# Altium schematic sheet RP2040.SchDoc
size A; SheetNumber: 3; SheetTotal: 3
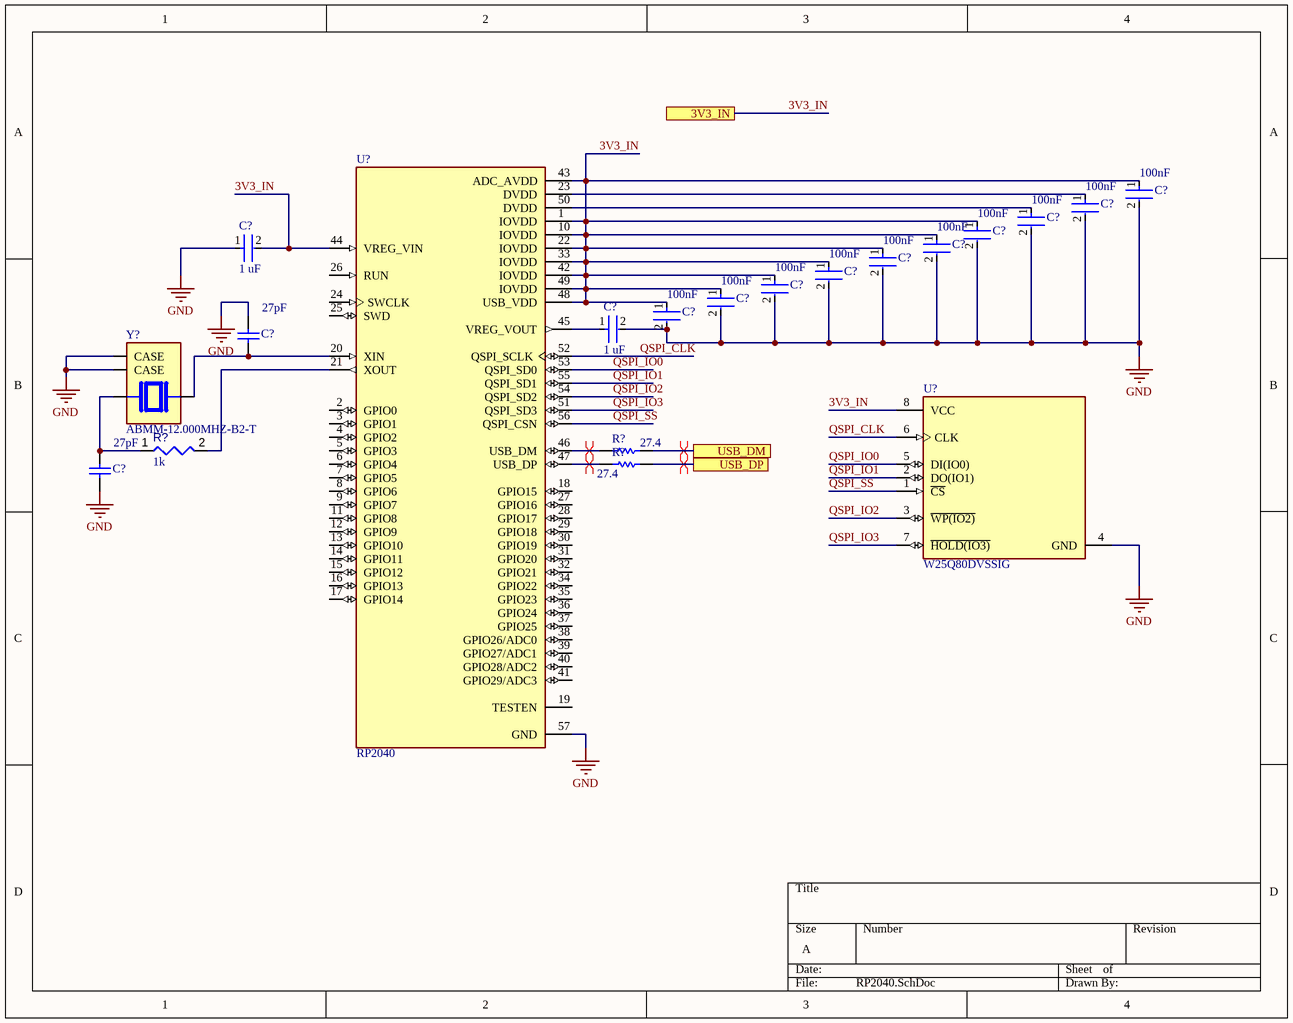
[diagram p0: RP2040.SchDoc]

## Parts
(Parts that share a designator on the sheet are numbered #1, #2 ... from top to bottom, then left to right.)
C?#1  Capacitance: 100nF  [FP-GRM155-0_05-MFG]  (hidden comment: GRM155R71C104KA88J)
C?#2  Capacitance: 100nF  [FP-GRM155-0_05-MFG]  (hidden comment: GRM155R71C104KA88J)
C?#3  Capacitance: 100nF  [FP-GRM155-0_05-MFG]  (hidden comment: GRM155R71C104KA88J)
C?#4  Capacitance: 100nF  [FP-GRM155-0_05-MFG]  (hidden comment: GRM155R71C104KA88J)
C?#5  Capacitance: 100nF  [FP-GRM155-0_05-MFG]  (hidden comment: GRM155R71C104KA88J)
C?#6  value 1 uF  [FP-CC0603-DA-MFG]  (hidden comment: CC0603KRX7R7BB105)
C?#7  Capacitance: 100nF  [FP-GRM155-0_05-MFG]  (hidden comment: GRM155R71C104KA88J)
C?#8  Capacitance: 100nF  [FP-GRM155-0_05-MFG]  (hidden comment: GRM155R71C104KA88J)
C?#9  Capacitance: 100nF  [FP-GRM155-0_05-MFG]  (hidden comment: GRM155R71C104KA88J)
C?#10  Capacitance: 100nF  [FP-GRM155-0_05-MFG]  (hidden comment: GRM155R71C104KA88J)
C?#11  Capacitance: 100nF  [FP-GRM155-0_05-MFG]  (hidden comment: GRM155R71C104KA88J)
C?#12  value 27pF  [CAPC1005X55X25LL05T10]  (hidden comment: GRM1555C1H270JA01D)
C?#13  value 1 uF  [FP-CC0603-DA-MFG]  (hidden comment: CC0603KRX7R7BB105)
C?#14  value 27pF  [CAPC1005X55X25LL05T10]  (hidden comment: GRM1555C1H270JA01D)
R?#1  value 27.4  [RESC1005X40X25ML05T10]  (hidden comment: RC0402FR-0727R4L)
R?#2  value 1k  [RESC1005X40X25ML10T10]  (hidden comment: Resistor 1k +/-5% 0402 63 mW)
R?#3  value 27.4  [RESC1005X40X25ML05T10]  (hidden comment: RC0402FR-0727R4L)
U?#1  W25Q80DVSSIG  [FP-SS-MFG]
U?#2  RP2040  [QFN40P700X700X90-57N]
Y?  ABMM-12.000MHZ-B2-T  [XTAL_ABMM-12.000MHZ-B2-T]

## Ports
3V3_IN, USB_DM, USB_DP

## Nets
GND: C?#1.2 C?#2.2 C?#3.2 C?#4.2 C?#5.2 C?#6.1 C?#7.2 C?#8.2 C?#9.2 C?#10.2 C?#11.2 C?#12.1 C?#13.2 C?#14.2 U?#1.4(GND) U?#2.57(GND) Y?.2(CASE) Y?.4(CASE)
3V3_IN: C?#1.1 C?#4.1 C?#5.1 C?#6.2 C?#7.1 C?#8.1 C?#9.1 C?#10.1 C?#11.1 U?#1.8(VCC) U?#2.1(IOVDD) U?#2.10(IOVDD) U?#2.22(IOVDD) U?#2.33(IOVDD) U?#2.42(IOVDD) U?#2.43(ADC_AVDD) U?#2.44(VREG_VIN) U?#2.48(USB_VDD) U?#2.49(IOVDD) ; port 3V3_IN
QSPI_CLK: U?#1.6(CLK) U?#2.52(QSPI_SCLK)
QSPI_IO0: U?#1.5(DI(IO0)) U?#2.53(QSPI_SD0)
QSPI_IO1: U?#1.2(DO(IO1)) U?#2.55(QSPI_SD1)
QSPI_IO2: U?#1.3(~{WP(IO2)}) U?#2.54(QSPI_SD2)
QSPI_IO3: U?#1.7(~{HOLD(IO3)}) U?#2.51(QSPI_SD3)
QSPI_SS: U?#1.1(~{CS}) U?#2.56(QSPI_CSN)
USB_DM: R?#1.2 ; port USB_DM
USB_DP: R?#3.2 ; port USB_DP
NetC?#2_1: C?#2.1 U?#2.23(DVDD)
NetC?#3_1: C?#3.1 U?#2.50(DVDD)
NetC?#12_2: C?#12.2 U?#2.20(XIN) Y?.1
NetC?#13_1: C?#13.1 U?#2.45(VREG_VOUT)
NetC?#14_1: C?#14.1 R?#2.1 Y?.3
NetR?#1_1: R?#1.1 U?#2.46(USB_DM)
NetR?#2_2: R?#2.2 U?#2.21(XOUT)
NetR?#3_1: R?#3.1 U?#2.47(USB_DP)

Not connected (* = marked no-connect by the designer): U?#2 2(GPIO0) 3(GPIO1) 4(GPIO2) 5(GPIO3) 6(GPIO4) 7(GPIO5) 8(GPIO6) 9(GPIO7) 11(GPIO8) 12(GPIO9) 13(GPIO10) 14(GPIO11) 15(GPIO12) 16(GPIO13) 17(GPIO14) 18(GPIO15) 19(TESTEN) 24(SWCLK) 25(SWD) 26(RUN) 27(GPIO16) 28(GPIO17) 29(GPIO18) 30(GPIO19) 31(GPIO20) 32(GPIO21) 34(GPIO22) 35(GPIO23) 36(GPIO24) 37(GPIO25) 38(GPIO26/ADC0) 39(GPIO27/ADC1) 40(GPIO28/ADC2) 41(GPIO29/ADC3)

## Layout directives
differential pair: NetR?#1_1, NetR?#3_1, USB_DM, USB_DP

## Library data of the parts
C?#1-C?#5 C?#7-C?#11 = CMP-2008-03928-2: NexarPartId: 9223238; Manufacturer Lifecycle Status: NRND; Voltage: 16V; Tolerance: 10%; Dielectric: X7R; Material: Ceramic; Schedule B: 8532240020, 8532240020; Mount: Surface Mount; Case/Package: 0402; Case Code (Imperial): 0402; Min Operating Temperature: -55°C; Length: 1mm; Voltage Rating (DC): 16V; Depth: 500µm; Lead Free: Lead Free; Max Operating Temperature: 125°C; Case Code (Metric): 1005; Radiation Hardening: No; Height: 550µm; Voltage Rating: 16V; Packaging: Cut Tape; RoHS: Compliant; Width: 500µm; Number of Pins: 2; REACH SVHC: No SVHC; Termination: SMD/SMT; Thickness: 500µm
C?#6 C?#13 = CMP-03422-000924-1: CAP CER 1UF 16V X7R 0603; Manufacturer: YAGEO; Tolerance: 0.1; Temperature Coefficient: 15%; Material: Ceramic; Package: CC0603-DA; RoHS: TRUE; Device Class L2: Capacitors; Temperature Characteristic: X7R; Temperature: -55°C to +125°C; Temperature Range Low: -55°C; Automotive: No; ComponentLink2Description: Datasheet; Lead Free: Yes; Capacitance: 1 uF; ComponentLink2URL: http://www.yageo.com/documents/recent/UPY-GPHC_X7R_6.3V-to-50V_18.pdf; Device Class L1: Passive Components; Voltage: 16 V; Octopart: https://octopart.com/cc0603krx7r7bb105-yageo-42271928; Category: Cap; Digikey Description: CAP CER 1UF 16V X7R 0603; Footprint Url: http://www.yageo.com/exep/pages/download/literatures/UPY-C_GEN_24.pdf; Height: 0.9mm; Manufacturer Part Number: CC0603KRX7R7BB105; Voltage Rating: 16 V; Temperature Range High: +125°C; Mouser Description: Multilayer Ceramic Capacitor, CC Series, 1 - F, - 10%, X7R, 16 V, 0603 [1608 Metric]; Device Class L3: Ceramic Capacitors
C?#12 C?#14 = CMP-2008-03917-1: Manufacturer: Murata; Part Number: GRM1555C1H270JA01D
R?#1 R?#3 = CMP-2002-07553-1: Manufacturer: Yageo / Phycomp; Part Number: RC0402FR-0727R4L
R?#2 = CMP-009-00013-5: Chip Resistor, 1 KOhm, +/- 5%, 0.063 W, -55 to 155 degC, 0402 (1005 Metric); Power: 63mW; Tolerance: 5%; Case/Package: 0402; Mounting Technology: SM; Min Operating Temperature: -55°C; Pins: 2; Max Operating Temperature: 155°C; RoHS Compliant: True
U?#1 = CMP-2000-07408-2: IC FLASH 8MBIT SPI 104MHZ 8SOIC; Memory Type: Non-Volatile; Memory Size: 8Mb; Frequency: 104MHz; Min Operating Temperature: -40°C; Mount: Surface Mount; RoHS Compliant: Yes; Packaging: Rail/Tube; Case/Package: SOIC; Max Operating Temperature: 85°C; Series: SpiFlash®; Interface: SPI
U?#2 = CMP-027-000000-1: RP2040 chip for Raspberry Pi Pico - ARM® Cortex®-M0+ MCU 32-Bit; MP: RP2040; Design Item ID: RP2040; SnapEDA_Link: https://www.snapeda.com/parts/RP2040/Raspberry+Pi/view-part/?ref=snap; Source: RP2040.SchLib; Pin Count: 57; Value: *; Component Type: Standard; MF: Raspberry Pi; Package: None; Check_prices: https://www.snapeda.com/parts/RP2040/Raspberry+Pi/view-part/?ref=eda
Y? = CMP-032-000000-1: Availability: Unavailable; Package: None; Price: None; Source: ABMM-12.000MHZ-B2-T.SchLib; Component Type: Standard; MP: ABMM-12.000MHZ-B2-T; Pin Count: 4; Value: *; Design Item ID: ABMM-12.000MHZ-B2-T